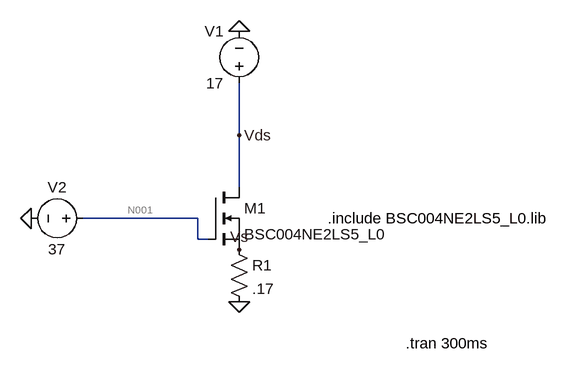
[diagram p0: schematic Draft1.asc]
Draft1.asc, the LTspice schematic file:
Version 4
SHEET 1 880 680
WIRE 208 32 208 -48
WIRE 208 112 208 32
WIRE 144 160 -32 160
WIRE 144 192 144 160
WIRE 160 192 144 192
FLAG 208 -128 0
FLAG 208 288 0
FLAG -112 160 0
FLAG 208 32 Vds
FLAG 208 208 Vs
SYMBOL nmos 160 112 R0
SYMATTR InstName M1
SYMATTR Value BSC004NE2LS5_L0
SYMATTR Prefix X
SYMBOL voltage 208 -32 R180
WINDOW 0 24 96 Left 2
WINDOW 3 24 16 Left 2
SYMATTR InstName V1
SYMATTR Value 17
SYMBOL voltage -16 160 R90
WINDOW 0 -32 56 VBottom 2
WINDOW 3 32 56 VTop 2
SYMATTR InstName V2
SYMATTR Value 37
SYMBOL res 192 192 R0
SYMATTR InstName R1
SYMATTR Value .17
TEXT 344 160 Left 2 !.include BSC004NE2LS5_L0.lib
TEXT 464 352 Left 2 !.tran 300ms

The netlist it stands for:
* Draft1.asc
XM1 Vds N001 Vs BSC004NE2LS5_L0  ; pins D G S
V1 Vds 0 17
V2 N001 0 37
R1 Vs 0 .17
.include BSC004NE2LS5_L0.lib
.tran 300ms
.backanno
.end

* Results of the author's LTspice run, read from the files saved beside the schematic
* Operating Point, zero values left out:
*   V(n001) = 37 V
*   V(vds) = 17 V
*   V(vs) = 16.77 V
*   I(R1) = 98.64 A
*   I(V1) = -98.64 A
*   I(V2) = -20.11 µA
*   Ix(m1:DRAIN) = 98.64 A
*   Ix(m1:GATE) = 20.11 µA
*   Ix(m1:SOURCE) = -98.64 A